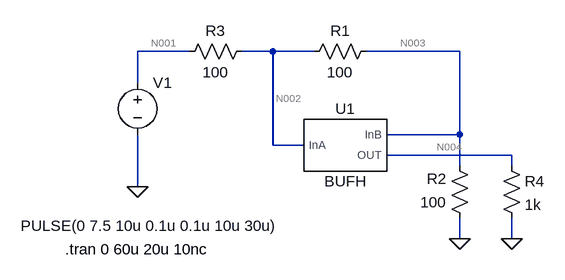
[diagram p0: schematic test_buf.asc]
test_buf.asc, the LTspice schematic file:
Version 4
SHEET 1 880 680
WIRE -48 0 -128 0
WIRE 80 0 32 0
WIRE 144 0 80 0
WIRE 368 0 224 0
WIRE -128 48 -128 0
WIRE 368 128 368 0
WIRE 368 128 256 128
WIRE 80 144 80 0
WIRE 128 144 80 144
WIRE 448 160 256 160
WIRE 368 176 368 128
WIRE 448 176 448 160
WIRE -128 208 -128 128
WIRE 368 288 368 256
WIRE 448 288 448 256
FLAG 368 288 0
FLAG -128 208 0
FLAG 448 288 0
SYMBOL res 240 -16 R90
WINDOW 0 0 56 VBottom 2
WINDOW 3 32 56 VTop 2
SYMATTR InstName R1
SYMATTR Value 100
SYMBOL res 384 272 R180
WINDOW 0 36 76 Left 2
WINDOW 3 36 40 Left 2
SYMATTR InstName R2
SYMATTR Value 100
SYMBOL res 48 -16 R90
WINDOW 0 0 56 VBottom 2
WINDOW 3 32 56 VTop 2
SYMATTR InstName R3
SYMATTR Value 100
SYMBOL voltage -128 32 R0
WINDOW 3 -180 236 Left 2
WINDOW 123 0 0 Left 0
WINDOW 39 0 0 Left 0
SYMATTR Value PULSE(0 7.5 10u 0.1u 0.1u 10u 30u)
SYMATTR InstName V1
SYMBOL res 432 160 R0
SYMATTR InstName R4
SYMATTR Value 1k
SYMBOL bufh 192 144 R0
SYMATTR InstName U1
TEXT -240 304 Left 2 !.tran 0 60u 20u 10nc

The netlist it stands for:
* test_buf.asc
R1 N003 N002 100
R2 0 N003 100
R3 N002 N001 100
V1 N001 0 PULSE(0 7.5 10u 0.1u 0.1u 10u 30u)
R4 N004 0 1k
XU1 N002 N003 N004 BUFH  ; pins InA InB OUT
.tran 0 60u 20u 10nc
.lib BufH.cir
.backanno
.end

* Results of the author's LTspice run, read from the files saved beside the schematic
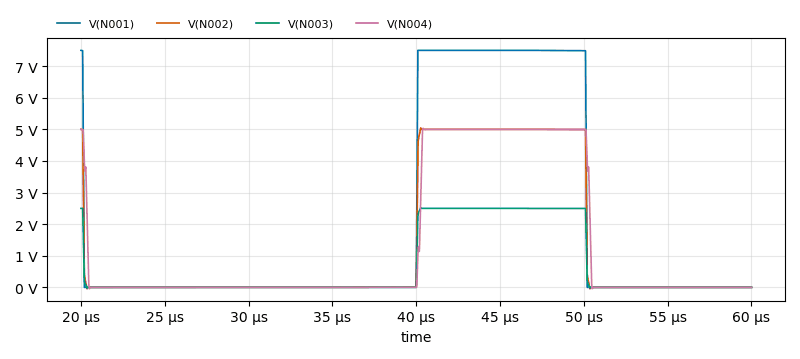
[diagram p1: Transient Analysis of test_buf.asc, plotted from the saved traces]
* Transient Analysis, 1 run:
*   V(N001): min 0 V, max 7.5 V, average 1.921 V, rms 3.787 V, last 0 V
*   V(N002): min -46.4 mV, max 5.045 V, average 1.282 V, rms 2.523 V, last 0 V
*   V(N003): min -25.87 mV, max 2.525 V, average 641 mV, rms 1.262 V, last 0 V
*   V(N004): min -42.72 mV, max 5.035 V, average 1.302 V, rms 2.531 V, last -919.9 µV